# EAGLE design P-431_MIDI_IN_BARE (EAGLE 6.0)
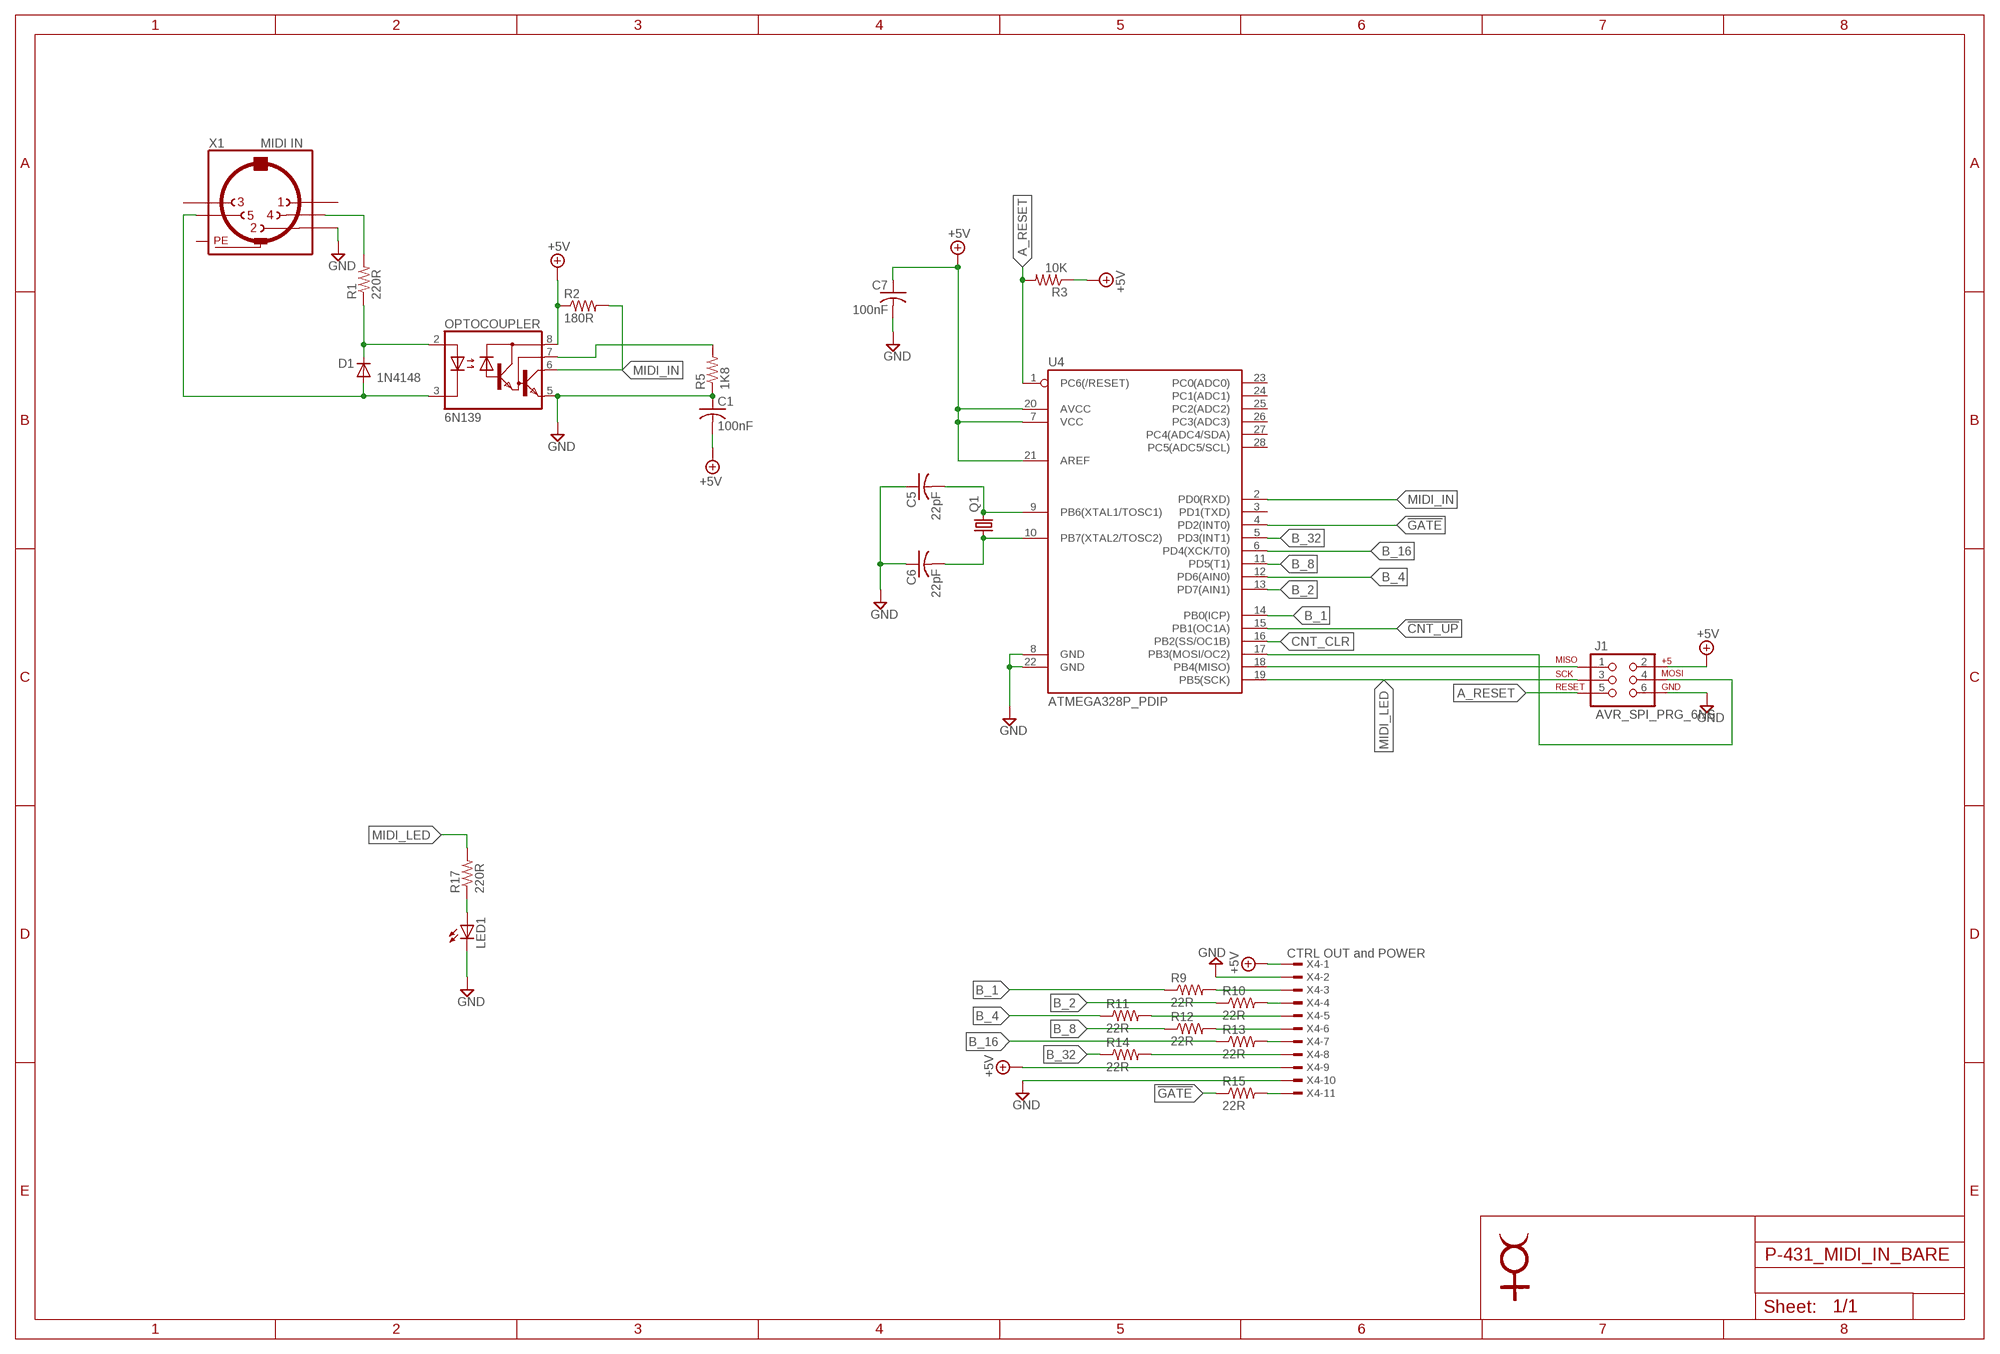
[diagram p0: schematic, sheet 1]
FRAME1 (A3L-LOC): AUTHOR_NAME: Alessio Degani; NOTES: Crumar P-431 MIDI

## Parts
C1  100nF  C-US050-025X075  [C050-025X075]
C5  22pF  C-US050-025X075  [C050-025X075]
C6  22pF  C-US050-025X075  [C050-025X075]
C7  100nF  C-US050-025X075  [C050-025X075]
D1  1N4148  DIODE1N4148  [DIODE-1N4148]
J1  AVR_SPI_PRG_6NS  [2X3-NS]
LED1  LED5MM  [LED5MM]
OPTOCOUPLER  6N139  6N138  [DIL08]
Q1  CRYSTALHC49S  [HC49/S]
R1  220R  R-US_0207/7  [0207/7]
R2  180R  R-US_0207/7  [0207/7]
R3  10K  R-US_0207/7  [0207/7]
R5  1K8  R-US_0207/7  [0207/7]
R9  22R  R-US_0207/7  [0207/7]
R10  22R  R-US_0207/7  [0207/7]
R11  22R  R-US_0207/7  [0207/7]
R12  22R  R-US_0207/7  [0207/7]
R13  22R  R-US_0207/7  [0207/7]
R14  22R  R-US_0207/7  [0207/7]
R15  22R  R-US_0207/7  [0207/7]
R17  220R  R-US_0207/7  [0207/7]
U4  ATMEGA328P_PDIP  [DIL28-3]
X1  MIDI IN  MAB5SH  [MAB5SH]
X4  CTRL OUT and POWER  TSW-111-02-S-S-RA  [TSW-111-02-S-S-RA]

## Nets
!CNT_UP: U4.15(PB1(OC1A))
!GATE: R15.1 U4.4(PD2(INT0))
+5V: C1.2 C7.1 J1.2 OPTOCOUPLER.8(VCC) R2.1 R3.1 U4.7(VCC) U4.20(AVCC) U4.21(AREF) X4.1 X4.9
A_RESET: J1.5 R3.2 U4.1(PC6(/RESET))
B_1: R9.1 U4.14(PB0(ICP))
B_2: R10.1 U4.13(PD7(AIN1))
B_4: R11.1 U4.12(PD6(AIN0))
B_8: R12.1 U4.11(PD5(T1))
B_16: R13.1 U4.6(PD4(XCK/T0))
B_32: R14.1 U4.5(PD3(INT1))
CNT_CLR: U4.16(PB2(SS/OC1B))
GND: C1.1 C5.1 C6.1 C7.2 J1.6 LED1.K(C) OPTOCOUPLER.5(GND) R5.1 U4.8(GND) U4.22(GND) X1.2 X4.2 X4.10
MIDI_IN: OPTOCOUPLER.6(VO) R2.2 U4.2(PD0(RXD))
MIDI_LED: J1.3 R17.2 U4.19(PB5(SCK))
N$1: D1.A OPTOCOUPLER.3(C) X1.5
N$2: D1.C OPTOCOUPLER.2(A) R1.1
N$3: R1.2 X1.4
N$4: OPTOCOUPLER.7(VB) R5.2
N$8: LED1.A R17.1
N$19: R9.2 X4.3
N$20: R10.2 X4.4
N$21: R11.2 X4.5
N$22: R12.2 X4.6
N$23: R13.2 X4.7
N$24: R14.2 X4.8
N$25: R15.2 X4.11
N$26: C5.2 Q1.2 U4.9(PB6(XTAL1/TOSC1))
N$27: C6.2 Q1.1 U4.10(PB7(XTAL2/TOSC2))
POT_DI: J1.1 U4.18(PB4(MISO))
POT_SCK: J1.4 U4.17(PB3(MOSI/OC2))
Unconnected: U4.3(PD1(TXD)) U4.23(PC0(ADC0)) U4.24(PC1(ADC1)) U4.25(PC2(ADC2)) U4.26(PC3(ADC3)) U4.27(PC4(ADC4/SDA)) U4.28(PC5(ADC5/SCL)) X1.1 X1.3

## Power pins joined to a net without a drawn wire
PE: X1.PE X1.PE@(PE)

## Library data of the parts
C1 C5-C7 = rcl:C-US: CAPACITOR, American symbol
D1 = SparkFun:DIODE: Diode These are standard reverse protection diodes and small signal diodes. SMA package can handle up to about 1A. SOD-323 can handle about 200mA. What the SOD-323 package when ordering, there are some mfgs out there that are 5-pin packages.
J1 = SparkFun:AVR_SPI_PRG_6: AVR ISP 6 Pin This is the reduced ISP connector for AVR programming. Common on Arduino. This footprint will take up less PCB space and can be used with a 10-pin to 6-pin adapter such as SKU: BOB-08508
LED1 = led:LED: LED OSRAM: - CHIPLED LG R971, LG N971, LY N971, LG Q971, LY Q971, LO R971, LY R971 LH N974, LH R974 LS Q976, LO Q976, LY Q976 LO Q996 - Hyper CHIPLED LW Q18S LB Q993, LB Q99A, LB R99A - SideLED LS A670, LO A670, LY A670, LG A670, LP A670 LB A673, LV A673, LT A673, LW A673 LH A674 LY A675 LS A676, LA A676, LO A676, LY A676, LW A676 LS A679, LY A679, LG A679 - Hyper Micro SIDELED® LS Y876, LA Y876, LO Y876, LY Y876 LT Y87S - SmartLED LW L88C, LW L88S LB L89C, LB L89S, LG L890 LS L89K, LO L89K, LY L89K LS L896, LA L896, LO L896, LY L896 - TOPLED LS T670, LO T670, LY T670, LG T670, LP T670 LSG T670, LSP T670, LSY T670, LOP T670, LYG T670 LG T671, LOG T671, LSG T671 LB T673, LV T673, LT T673, LW T673 LH T674 LS T676, LA T676, LO T676, LY T676, LB T676, LH T676, LSB T676, LW T676 LB T67C, LV T67C, LT T67C, LS T67K, LO T67K, LY T67K, LW E67C LS E67B, LA E67B, LO E67B, LY E67B, LB E67C, LV E67C, LT E67C LW T67C LS T679, LY T679, LG T679 LS T770, LO T770, LY T770, LG T770, LP T770 LB T773, LV T773, LT T773, LW T773 LH T774 LS E675, LA E675, LY E675, LS T675 LS T776, LA T776, LO T776, LY T776, LB T776 LHGB T686 LT T68C, LB T68C - Hyper Mini TOPLED® LB M676 - Mini TOPLED Santana® LG M470 LS M47K, LO M47K, LY M47K Source: http://www.osram.convergy.de LUXEON: - LUMILED® LXK2-PW12-R00, LXK2-PW12-S00, LXK2-PW14-U00, LXK2-PW14-V00 LXK2-PM12-R00, LXK2-PM12-S00, LXK2-PM14-U00 LXK2-PE12-Q00, LXK2-PE12-R00, LXK2-PE12-S00, LXK2-PE14-T00, LXK2-PE14-U00 LXK2-PB12-K00, LXK2-PB12-L00, LXK2-PB12-M00, LXK2-PB14-N00, LXK2-PB14-P00, LXK2-PB14-Q00 LXK2-PR12-L00, LXK2-PR12-M00, LXK2-PR14-Q00, LXK2-PR14-R00 LXK2-PD12-Q00, LXK2-PD12-R00, LXK2-PD12-S00 LXK2-PH12-R00, LXK2-PH12-S00 LXK2-PL12-P00, LXK2-PL12-Q00, LXK2-PL12-R00 Source: www.luxeon.com KINGBRIGHT: KA-3528ASYC Source: www.kingbright.com
OPTOCOUPLER = optocoupler:6N138: MOTOROLA OPTO COUPLER; MF: VISHAY/TELEFUNKEN; MPN: 6N138; OC_FARNELL: 9860150; OC_NEWARK: 35K5294
Q1 = crystal:CRYSTAL: CRYSTAL; OC_FARNELL: 1667008; OC_NEWARK: unknown
R1-R3 R5 R9-R15 R17 = resistor:R-US_: RESISTOR, American symbol
U4 = SparkFun-DigitalIC:ATMEGA328P_PDIP: uC used in the Arduino 32kb flash, 1k EEPROM, 2k SRAM This is the through-hole version of this chip.
X1 = con-hirschmann:MAB5SH: Female CONNECTOR 5 pins 90 deg. with shield, horizontal (DIN 41524); OC_FARNELL: 809883; OC_NEWARK: unknown
X4 = con-samtec:TSW-111-02-S-S: THROUGH-HOLE .025" SQ POST HEADER Source: Samtec TSW.pdf; OC_FARNELL: unknown; OC_NEWARK: unknown

## Board
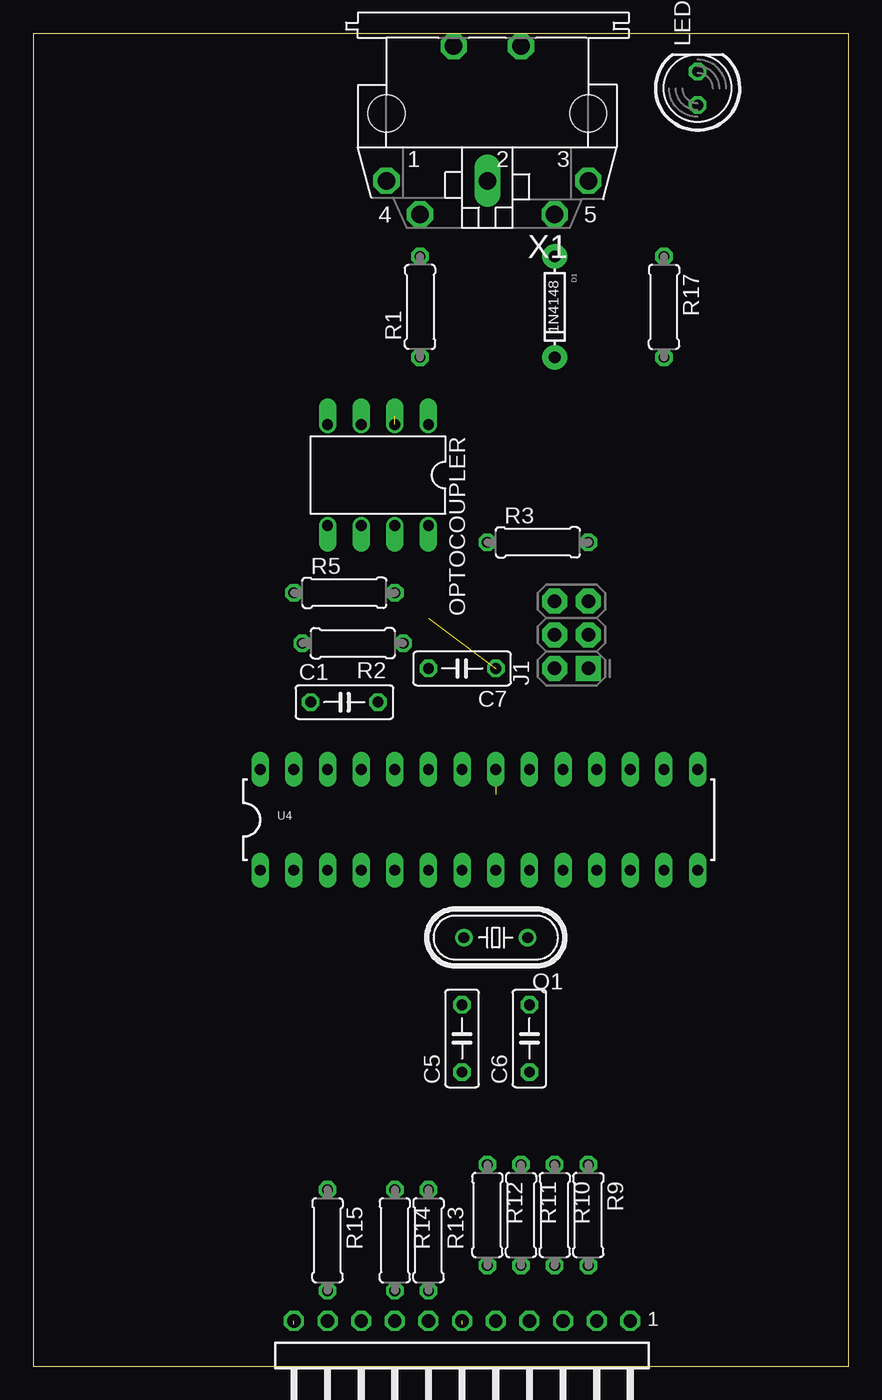
[diagram p1: board, top side]
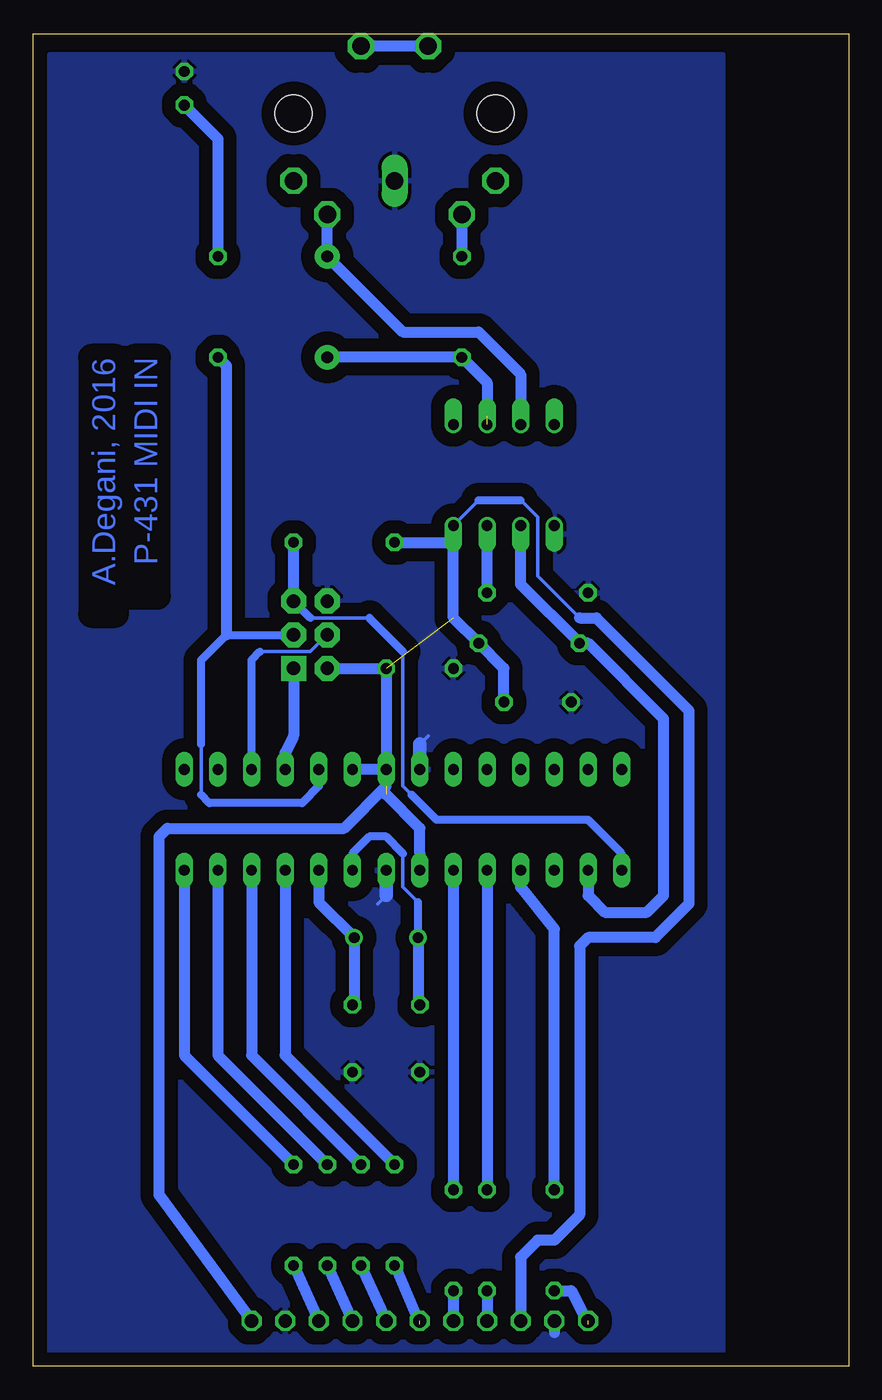
[diagram p2: board, bottom side, seen from below]

Size 61.58 x 100.64 mm. Coordinates in mm from the lower left corner, seen from the top.
Outline: 0,0 61.58,0 61.58,100.64 0,100.64 0,0
Copper layers (1*16): Top 0.035mm / dielectric 1.5mm / Bottom 0.035mm
Design rules: minimum track width 10mil, minimum drill 24mil, track to track 40mil, track to pad 40mil, pad to pad 20mil, via to via 20mil, smd to smd 8mil, copper to edge 40mil, drill to drill 8mil, minimum pad ring 10mil, minimum via ring 8mil, stop-mask expansion 4mil, vias tented up to drill 0mil, thermal gap 10mil

### Footprints (pad centres in the part's own frame; a part is rotated, then mirrored left to right if it is on the bottom)
C050-025X075 = drill 0.813 octagon: 1 -2.54,0; 2 2.54,0
DIODE-1N4148 = drill 0.9 pad 1.88: A -3.81,0; C 3.81,0
2X3-NS = drill 1.016 pad 1.88 square: 1 -2.54,-1.27 | drill 1.016 pad 1.88 octagon: 2 -2.54,1.27; 3 0,-1.27; 4 0,1.27; 5 2.54,-1.27; 6 2.54,1.27
LED5MM = drill 0.813 octagon: A -1.27,0; K 1.27,0
DIL08 = drill 0.813 offset: 1 -3.81,-3.81; 2 -1.27,-3.81; 3 1.27,-3.81; 4 3.81,-3.81; 5 3.81,3.81; 6 1.27,3.81; 7 -1.27,3.81; 8 -3.81,3.81
HC49/S = drill 0.813: 1 -2.413,0; 2 2.413,0
0207/7 = drill 0.813 octagon: 1 -3.81,0; 2 3.81,0
DIL28-3 = drill 0.813 long: 1 -16.51,-3.81; 2 -13.97,-3.81; 3 -11.43,-3.81; 4 -8.89,-3.81; 5 -6.35,-3.81; 6 -3.81,-3.81; 7 -1.27,-3.81; 8 1.27,-3.81; 9 3.81,-3.81; 10 6.35,-3.81; 11 8.89,-3.81; 12 11.43,-3.81; 13 13.97,-3.81; 14 16.51,-3.81; 15 16.51,3.81; 16 13.97,3.81; 17 11.43,3.81; 18 8.89,3.81; 19 6.35,3.81; 20 3.81,3.81; 21 1.27,3.81; 22 -1.27,3.81; 23 -3.81,3.81; 24 -6.35,3.81; 25 -8.89,3.81; 26 -11.43,3.81; 27 -13.97,3.81; 28 -16.51,3.81
MAB5SH = drill 1.321 octagon: 1 7.62,5.08; 3 -7.62,5.08; 4 5.08,7.62; 5 -5.08,7.62; PE -2.54,-5.08; PE@ 2.54,-5.08 | drill 1.321 long: 2 0,5.08 | hole 2.794: 7.62,0; -7.62,0
TSW-111-02-S-S-RA = drill 1 pad 1.5 octagon: 1 12.7,1.524; 2 10.16,1.524; 3 7.62,1.524; 4 5.08,1.524; 5 2.54,1.524; 6 0,1.524; 7 -2.54,1.524; 8 -5.08,1.524; 9 -7.62,1.524; 10 -10.16,1.524; 11 -12.7,1.524

### Placement (x,y rotation side)
C1  23.5,50.16 0 top
C5  32.38,24.77 90 top
C6  37.47,24.77 90 top
C7  32.38,52.7 180 top
D1  39.37,80.01 270 top
J1  40.64,55.24 90 top
LED1  50.16,96.52 90 top
OPTOCOUPLER  26.04,67.31 180 top
Q1  34.92,32.38 180 top
R1  29.21,80.01 90 top
R2  24.13,54.61 180 top
R3  38.1,62.23 0 top
R5  23.5,58.42 0 top
R9  41.91,11.43 270 top
R10  39.37,11.43 270 top
R11  36.83,11.43 270 top
R12  34.29,11.43 270 top
R13  29.84,9.53 270 top
R14  27.3,9.53 270 top
R15  22.23,9.53 270 top
R17  47.62,80.01 270 top
U4  33.66,41.27 0 top
X1  34.29,94.62 180 top
X4  32.38,1.91 0 top

### Tracks (layer width: path | path; a pad name or v marks a point on that pad's centre or on a via)
!GATE
  Bottom 0.813: R15.1 22.23,33.02 24.77,36.2 U4.4
+5V  (2 unrouted)
  Bottom 0.254: U4.7 32.38,38.73 | OPTOCOUPLER.8 27.94,65.41 | 24.77,65.41 23.5,64.14 23.5,59.69 20.32,56.52
  Bottom 0.61: 27.94,65.41 24.77,65.41
  Bottom 0.813: X4.1 52.07,12.95 52.07,40 51.44,40.64 38.1,40.64 34.92,43.81 U4.21 | U4.21 U4.20 | J1.2 C7.1 U4.21 | X4.9 24.77,8.26 23.5,9.53 22.23,9.53 20.32,11.43 20.32,31.75 19.68,32.38 14.61,32.38 12.06,34.92 12.06,49.53 19.05,56.52 20.32,56.52 | C1.2 26.04,52.7 R2.1 29.84,56.52 29.84,62.23 | OPTOCOUPLER.8 29.84,62.86 29.84,62.23 | 32.38,38.73 32.38,40.64 34.92,43.18 | R3.1 29.84,62.23
A_RESET
  Bottom 0.254: U4.1 17.14,38.73 | 33.02,43.18 33.66,43.81 33.66,53.98 | 36.2,56.52 40.64,56.52
  Bottom 0.61: 17.14,38.73 19.68,41.27 31.11,41.27 33.02,43.18 | 33.66,53.98 36.2,56.52 | 40.64,56.52 J1.5
  Bottom 0.813: J1.5 R3.2
B_1
  Bottom 0.813: U4.14 50.16,23.5 R9.1
B_2
  Bottom 0.813: U4.13 47.62,23.5 R10.1
B_4
  Bottom 0.813: U4.12 45.09,23.5 R11.1
B_8
  Bottom 0.813: U4.11 42.55,23.5 R12.1
B_16
  Bottom 0.813: U4.6 R13.1
B_32
  Bottom 0.813: U4.5 R14.1
GND
  Bottom 0.254: 34.92,35.56 35.56,34.92 | 32.38,46.99 31.75,47.62
  Bottom 0.813: X4.10 22.23,2.54
  Bottom 1.016: U4.8 34.92,35.56 | U4.22 32.38,46.99
  pour Bottom: 9.53,99.06 60.33,99.06 60.33,0.64 9.53,-1.27
MIDI_IN
  Bottom 0.813: U4.2 19.68,35.56 18.41,34.29 15.24,34.29 13.97,35.56 13.97,48.89 19.68,54.61 R2.2 24.77,59.05 OPTOCOUPLER.6
MIDI_LED
  Bottom 0.254: U4.19 40.01,43.81 | 48.9,43.18 48.9,46.99
  Bottom 0.61: 40.01,43.81 41.27,42.54 48.26,42.54 48.9,43.18 | 48.9,46.99 48.9,49.53 48.9,53.34 46.99,55.24 J1.3
  Bottom 0.813: R17.2 46.99,75.57 46.99,55.24
N$1
  Bottom 0.813: X1.5 D1.A 33.66,78.11 27.94,78.11 24.77,74.93 OPTOCOUPLER.3
N$2  (1 unrouted)
  Bottom 0.813: D1.C R1.1 27.3,74.3 27.3,71.76
N$3
  Bottom 0.813: X1.4 R1.2
N$4
  Bottom 0.813: R5.2 OPTOCOUPLER.7
N$8
  Bottom 0.813: LED1.A 47.62,92.71 R17.1
N$19
  Bottom 0.813: R9.2 X4.3
N$20
  Bottom 0.813: R10.2 X4.4
N$21
  Bottom 0.813: R11.2 X4.5
N$22  (1 unrouted)
  Bottom 0.813: R12.2 32.38,3.17
N$23
  Bottom 0.813: R13.2 X4.7
N$24
  Bottom 0.813: R14.2 X4.8
N$25  (1 unrouted)
  Bottom 0.813: R15.2 20.95,5.71 19.68,3.17
N$26
  Bottom 0.254: 32.51,35.05 33.66,36.2 33.66,38.73
  Bottom 0.61: Q1.2 32.51,35.05 | 33.66,38.73 34.92,40 36.2,40 37.47,38.73 U4.9
  Bottom 0.813: Q1.2 32.51,27.43 C5.2
N$27
  Bottom 0.813: C6.2 37.34,27.43 Q1.1 40.01,35.05 U4.10
PE
  Bottom 0.813: X1.PE@ X1.PE
POT_DI
  Bottom 0.813: J1.1 41.91,47.62 42.55,46.35 U4.18
POT_SCK
  Bottom 0.254: 44.45,53.98 40.64,53.98 J1.4
  Bottom 0.61: U4.17 45.09,53.34 44.45,53.98

### Text on the board
Bottom: P-431 MIDI IN | A.Degani, 2016